# EAGLE schematic 4key1SliderCapsenseDesign (EAGLE 6.3)
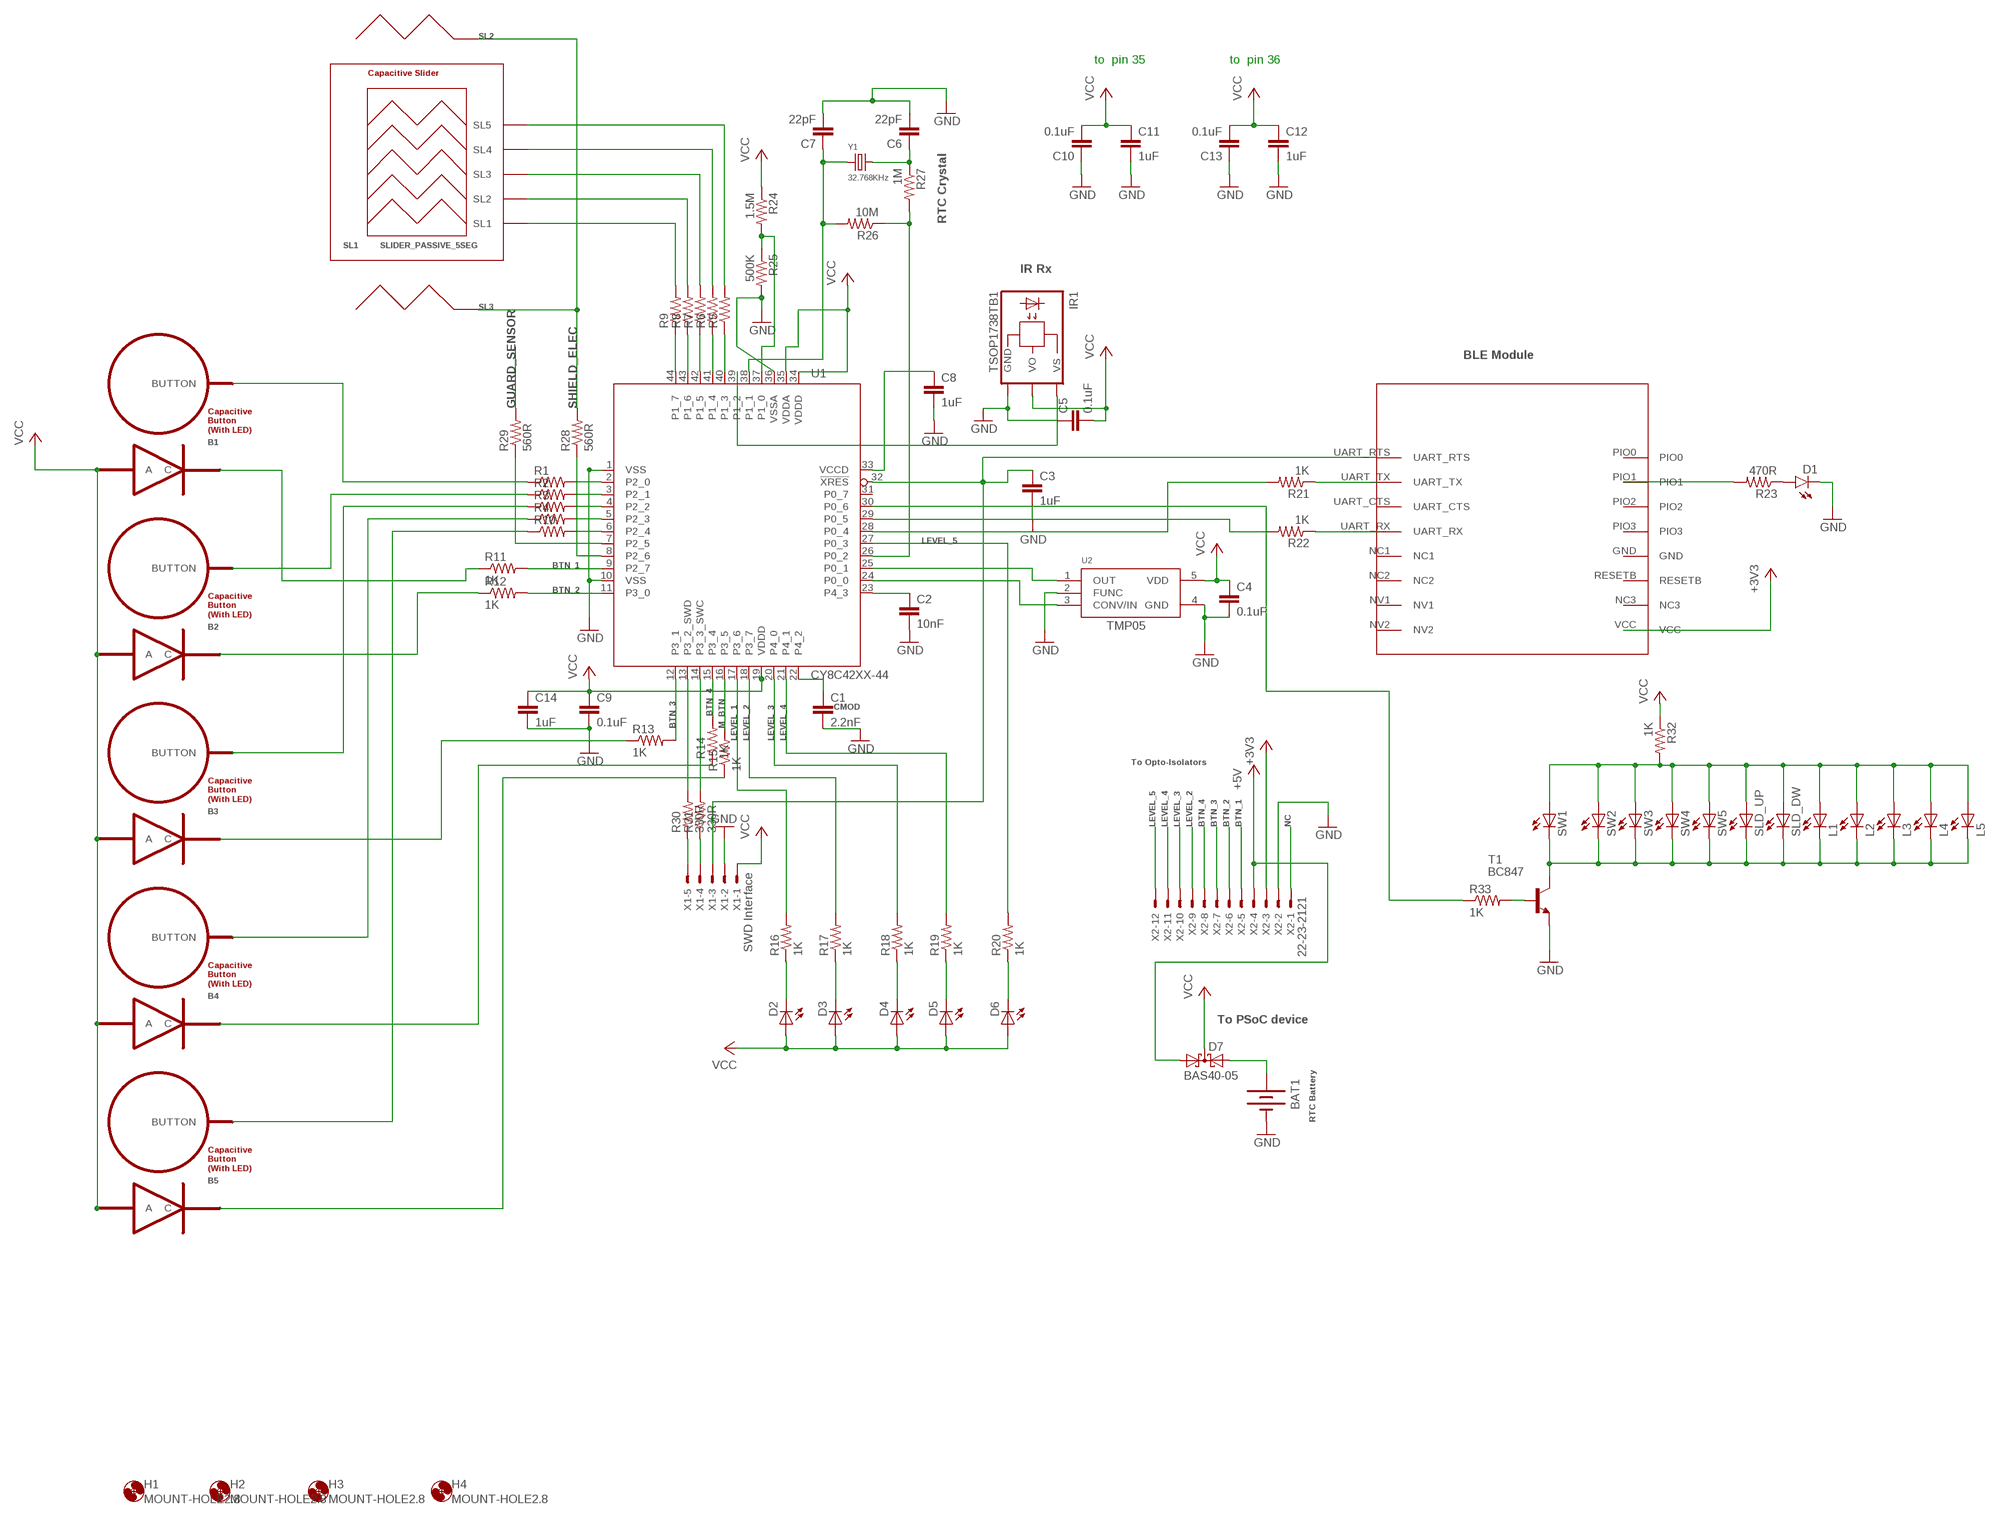
[diagram p0: schematic, sheet 1]

## Parts
B1  BUTTON_PASSIVE_LED  [BUTTON_PASSIVE_12MM_LED]
B2  BUTTON_PASSIVE_LED  [BUTTON_PASSIVE_12MM_LED]
B3  BUTTON_PASSIVE_LED  [BUTTON_PASSIVE_12MM_LED]
B4  BUTTON_PASSIVE_LED  [BUTTON_PASSIVE_12MM_LED]
B5  BUTTON_PASSIVE_LED  [BUTTON_PASSIVE_12MM_LED]
BAT1  BATTERY245MM  [BATTCON_245MM]
C1  2.2nF  CAP1206  [1206]
C2  10nF  CAP1206  [1206]
C3  1uF  CAP1206  [1206]
C4  0.1uF  CAP1206  [1206]
C5  0.1uF  CAP1206  [1206]
C6  22pF  CAP1206  [1206]
C7  22pF  CAP1206  [1206]
C8  1uF  CAP1206  [1206]
C9  0.1uF  CAP1206  [1206]
C10  0.1uF  CAP1206  [1206]
C11  1uF  CAP1206  [1206]
C12  1uF  CAP1206  [1206]
C13  0.1uF  CAP1206  [1206]
C14  1uF  CAP1206  [1206]
D1  LED1206-BOTTOM  [LED-1206-BOTTOM]
D2  LEDCHIP-LED0805  [CHIP-LED0805]
D3  LEDCHIP-LED0805  [CHIP-LED0805]
D4  LEDCHIP-LED0805  [CHIP-LED0805]
D5  LEDCHIP-LED0805  [CHIP-LED0805]
D6  LEDCHIP-LED0805  [CHIP-LED0805]
D7  BAS40-05  [SOT23]
H1  MOUNT-HOLE2.8  [2,8]
H2  MOUNT-HOLE2.8  [2,8]
H3  MOUNT-HOLE2.8  [2,8]
H4  MOUNT-HOLE2.8  [2,8]
IR1  TSOP1738TB1  [TSOP17_TB1]
L1  LEDCHIPLED_1206  [CHIPLED_1206]
L2  LEDCHIPLED_1206  [CHIPLED_1206]
L3  LEDCHIPLED_1206  [CHIPLED_1206]
L4  LEDCHIPLED_1206  [CHIPLED_1206]
L5  LEDCHIPLED_1206  [CHIPLED_1206]
R1  RESISTOR1206  [1206]
R2  RESISTOR1206  [1206]
R3  RESISTOR1206  [1206]
R4  RESISTOR1206  [1206]
R5  RESISTOR1206  [1206]
R6  RESISTOR1206  [1206]
R7  RESISTOR1206  [1206]
R8  RESISTOR1206  [1206]
R9  RESISTOR1206  [1206]
R10  RESISTOR1206  [1206]
R11  1K  RESISTOR1206  [1206]
R12  1K  RESISTOR1206  [1206]
R13  1K  RESISTOR1206  [1206]
R14  1K  RESISTOR1206  [1206]
R15  1K  RESISTOR1206  [1206]
R16  1K  RESISTOR1206  [1206]
R17  1K  RESISTOR1206  [1206]
R18  1K  RESISTOR1206  [1206]
R19  1K  RESISTOR1206  [1206]
R20  1K  RESISTOR1206  [1206]
R21  1K  RESISTOR1206  [1206]
R22  1K  RESISTOR1206  [1206]
R23  470R  RESISTOR1206  [1206]
R24  1.5M  RESISTOR1206  [1206]
R25  500K  RESISTOR1206  [1206]
R26  10M  RESISTOR1206  [1206]
R27  1M  RESISTOR1206  [1206]
R28  560R  RESISTOR1206  [1206]
R29  560R  RESISTOR1206  [1206]
R30  330R  RESISTOR1206  [1206]
R31  330R  RESISTOR1206  [1206]
R32  1K  RESISTOR1206  [1206]
R33  1K  RESISTOR1206  [1206]
SL1  SLIDER_PASSIVE_5SEG  [SLIDER_PASSIVE_5SEG_12MM]
SL2  SLIDER_PASSIVE_1SEG  [SLIDER_PASSIVE_1SEG_12MM]
SL3  SLIDER_PASSIVE_1SEG  [SLIDER_PASSIVE_1SEG_12MM]
SLD_DW  LEDCHIPLED_1206  [CHIPLED_1206]
SLD_UP  LEDCHIPLED_1206  [CHIPLED_1206]
SW1  LEDCHIPLED_1206  [CHIPLED_1206]
SW2  LEDCHIPLED_1206  [CHIPLED_1206]
SW3  LEDCHIPLED_1206  [CHIPLED_1206]
SW4  LEDCHIPLED_1206  [CHIPLED_1206]
SW5  LEDCHIPLED_1206  [CHIPLED_1206]
T1  BC847  [SOT23]
U1  CY8C42XX-44  [TQFP-10X10-44]
U2  NCP1400A_STEPUP  [SOT23-5]
U$1  HM-11  [HM-11]
X1  SWD Interface  22-23-2051  [22-23-2051]
X2  22-23-2121  [22-23-2121]
Y1  32.768KHz  CRYSTAL32.768  [CRYSTAL_CYL_2X6MM_SMT]

## Nets
+3V3: U$1.VCC X2.3
+5V: D7.1(A1) X2.4
BTN_1: R11.2 U1.9(P2_7) X2.5
BTN_2: R12.2 U1.11(P3_0) X2.6
BTN_3: R13.2 U1.12(P3_1) X2.7
BTN_4: R14.2 U1.15(P3_4) X2.8
GND: BAT1.2(-) C1.2 C2.2 C3.2 C4.2 C5.1 C6.2 C7.2 C8.2 C9.2 C10.1 C11.2 C12.2 C13.1 C14.2 D1.C IR1.GND R25.2 T1.2(E) U1.1(VSS) U1.10(VSS) U1.36(VSSA) U2.2(FUNC) U2.4(GND) X1.2 X2.2
GUARD_SENSOR: R29.1 R29.2 U1.7(P2_5)
LEVEL_1: R16.2 U1.17(P3_6)
LEVEL_2: R17.2 U1.18(P3_7) X2.9
LEVEL_3: R18.2 U1.20(P4_0) X2.10
LEVEL_4: R19.2 U1.21(P4_1) X2.11
LEVEL_5: R20.2 U1.27(P0_3) X2.12
M_BTN: R15.2 U1.16(P3_5)
N$1: C1.1 U1.22(P4_2)
N$2: R1.2 U1.2(P2_0)
N$3: C2.1 U1.23(P4_3)
N$4: R2.2 U1.3(P2_1)
N$5: R3.2 U1.4(P2_2)
N$6: R4.2 U1.5(P2_3)
N$7: B1.BUTTON R1.1
N$8: B2.BUTTON R2.1
N$9: B3.BUTTON R3.1
N$10: B4.BUTTON R4.1
N$11: R10.2 U1.6(P2_4)
N$12: B5.BUTTON R10.1
N$13: R5.1 U1.40(P1_3)
N$14: R6.1 U1.41(P1_4)
N$15: R7.1 U1.42(P1_5)
N$16: R8.1 U1.43(P1_6)
N$17: R9.1 U1.44(P1_7)
N$18: R9.2 SL1.SL1
N$19: R8.2 SL1.SL2
N$20: R7.2 SL1.SL3
N$21: R6.2 SL1.SL4
N$22: R5.2 SL1.SL5
N$23: R28.1 U1.8(P2_6)
N$24: B1.C R11.1
N$25: B2.C R12.1
N$26: B3.C R13.1
N$27: B4.C R14.1
N$28: B5.C R15.1
N$29: R30.2 U1.13(P3_2_SWD)
N$30: C8.1 U1.33(VCCD)
N$31: R30.1 X1.5
N$32: R31.2 U1.14(P3_3_SWC)
N$33: R31.1 X1.4
N$34: L1.A L2.A L3.A L4.A L5.A R32.2 SLD_DW.A SLD_UP.A SW1.A SW2.A SW3.A SW4.A SW5.A
N$35: D2.C R16.1
N$36: L1.C L2.C L3.C L4.C L5.C SLD_DW.C SLD_UP.C SW1.C SW2.C SW3.C SW4.C SW5.C T1.3(C)
N$37: D3.C R17.1
N$38: R33.2 T1.1(B)
N$39: BAT1.1(+) D7.2(A2)
N$41: C3.1 U1.32(!XRES) U$1.UART_RTS X1.3
N$42: R21.1 U$1.UART_TX
N$43: R33.1 U1.30(P0_6)
N$44: R22.1 U$1.UART_RX
N$45: R21.2 U1.28(P0_4)
N$46: R22.2 U1.29(P0_5)
N$47: D1.A R23.1
N$48: U1.24(P0_0) U2.3(CONV/IN)
N$49: R23.2 U$1.PIO1
N$50: U1.25(P0_1) U2.1(OUT)
N$51: IR1.VS U1.39(P1_2)
N$52: R24.2 R25.1 U1.37(P1_0)
N$57: R26.1 R27.2 U1.26(P0_2)
N$58: C6.1 R27.1 Y1.2
N$59: C7.1 R26.2 U1.38(P1_1) Y1.1
N$61: D6.C R20.1
N$63: D5.C R19.1
N$64: D4.C R18.1
NC: X2.1
SHIELD_ELEC: R28.2 SL2.S1(SL1) SL3.S1(SL1)
VCC: B1.A B2.A B3.A B4.A B5.A C4.1 C5.2 C9.1 C10.2 C11.1 C12.1 C13.2 C14.1 D2.A D3.A D4.A D5.A D6.A D7.3(C) IR1.VO R24.1 R32.1 U1.19(VDDD) U1.34(VDDD) U1.35(VDDA) U2.5(VDD) X1.1
Unconnected: U1.31(P0_7) U$1.GND U$1.NC1 U$1.NC2 U$1.NC3 U$1.NV1 U$1.NV2 U$1.PIO0 U$1.PIO2 U$1.PIO3 U$1.RESETB U$1.UART_CTS

## Notes on the sheet
- to  pin 35 | to  pin 36
- RTC Crystal
- IR Rx
- BLE Module
- TMP05
- CMOD
- To Opto-Isolators
- To PSoC device
- RTC Battery

## Library data of the parts
B1-B5 = PatternAgents-TouchWidgets:BUTTON_PASSIVE_LED: Button, Passive Touch/Capacitive Sensing Type, with LED & Hole Source : http://www.PatternAgents.com Github : https://github.com/PatternAgents License : http://creativecommons.org/licenses/by-sa/3.1/ (Creative Commons 3.1) THIS SOFTWARE IS PROVIDED BY THE CONTRIBUTORS "AS IS" AND WITHOUT ANY EXPRESS OR IMPLIED WARRANTIES, INCLUDING, BUT NOT LIMITED TO, THE IMPLIED WARRANTIES OF MERCHANTABILITY AND FITNESS FOR A PARTICULAR PURPOSE ARE DISCLAIMED. IN NO EVENT SHALL THE COPYRIGHT OWNER OR CONTRIBUTORS BE LIABLE FOR ANY DIRECT, INDIRECT, INCIDENTAL, SPECIAL, EXEMPLARY, OR CONSEQUENTIAL DAMAGES (INCLUDING, BUT NOT LIMITED TO, PROCUREMENT OF SUBSTITUTE GOODS OR SERVICES; LOSS OF USE, DATA, OR PROFITS; OR BUSINESS INTERRUPTION) HOWEVER CAUSED AND ON ANY THEORY OF LIABILITY, WHETHER IN CONTRACT, STRICT LIABILITY, OR TORT (INCLUDING NEGLIGENCE OR OTHERWISE) ARISING IN ANY WAY OUT OF THE USE OF THIS SOFTWARE, EVEN IF ADVISED OF THE POSSIBILITY OF SUCH DAMAGE.
BAT1 = SparkFun-Electromechanical:BATTERY: Battery Holders Various common sizes : AA, AAA, 18650 (PRT-12895), 20mm coin cell and 12mm coin cell. 20MM_4LEGS, BATT-10373
C1-C14 = SparkFun-Capacitors:CAP: Capacitor Standard 0603 ceramic capacitor, and 0.1" leaded capacitor.
D1 = SparkFun-LED:LED: LEDs Standard schematic elements and footprints for 5mm, 3mm, 1206, and 0603 sized LEDs. 5mm - Spark Fun Electronics SKU : COM-00529 (and others)
D2-D6 L1-L5 SLD_DW SLD_UP SW1-SW5 = led:LED: LED OSRAM: - CHIPLED LG R971, LG N971, LY N971, LG Q971, LY Q971, LO R971, LY R971 LH N974, LH R974 LS Q976, LO Q976, LY Q976 LO Q996 - Hyper CHIPLED LW Q18S LB Q993, LB Q99A, LB R99A - SideLED LS A670, LO A670, LY A670, LG A670, LP A670 LB A673, LV A673, LT A673, LW A673 LH A674 LY A675 LS A676, LA A676, LO A676, LY A676, LW A676 LS A679, LY A679, LG A679 - Hyper Micro SIDELED® LS Y876, LA Y876, LO Y876, LY Y876 LT Y87S - SmartLED LW L88C, LW L88S LB L89C, LB L89S, LG L890 LS L89K, LO L89K, LY L89K LS L896, LA L896, LO L896, LY L896 - TOPLED LS T670, LO T670, LY T670, LG T670, LP T670 LSG T670, LSP T670, LSY T670, LOP T670, LYG T670 LG T671, LOG T671, LSG T671 LB T673, LV T673, LT T673, LW T673 LH T674 LS T676, LA T676, LO T676, LY T676, LB T676, LH T676, LSB T676, LW T676 LB T67C, LV T67C, LT T67C, LS T67K, LO T67K, LY T67K, LW E67C LS E67B, LA E67B, LO E67B, LY E67B, LB E67C, LV E67C, LT E67C LW T67C LS T679, LY T679, LG T679 LS T770, LO T770, LY T770, LG T770, LP T770 LB T773, LV T773, LT T773, LW T773 LH T774 LS E675, LA E675, LY E675, LS T675 LS T776, LA T776, LO T776, LY T776, LB T776 LHGB T686 LT T68C, LB T68C - Hyper Mini TOPLED® LB M676 - Mini TOPLED Santana® LG M470 LS M47K, LO M47K, LY M47K Source: http://www.osram.convergy.de LUXEON: - LUMILED® LXK2-PW12-R00, LXK2-PW12-S00, LXK2-PW14-U00, LXK2-PW14-V00 LXK2-PM12-R00, LXK2-PM12-S00, LXK2-PM14-U00 LXK2-PE12-Q00, LXK2-PE12-R00, LXK2-PE12-S00, LXK2-PE14-T00, LXK2-PE14-U00 LXK2-PB12-K00, LXK2-PB12-L00, LXK2-PB12-M00, LXK2-PB14-N00, LXK2-PB14-P00, LXK2-PB14-Q00 LXK2-PR12-L00, LXK2-PR12-M00, LXK2-PR14-Q00, LXK2-PR14-R00 LXK2-PD12-Q00, LXK2-PD12-R00, LXK2-PD12-S00 LXK2-PH12-R00, LXK2-PH12-S00 LXK2-PL12-P00, LXK2-PL12-Q00, LXK2-PL12-R00 Source: www.luxeon.com KINGBRIGHT: KA-3528ASYC Source: www.kingbright.com
D7 = diode:BAS40-05: Silicon Schottky Diodes General-purpose diode for high-speed switching
H1-H4 = holes:MOUNT-HOLE: MOUNTING HOLE with drill center marker
IR1 = telefunken:TSOP17*TB1: TSOP17..TB1 IR Receiver Modules for Remote Control Systems Source: http://www.vishay.com/docs/82042/82042.pdf; OC_FARNELL: unknown; OC_NEWARK: unknown
R1-R33 = SparkFun-Passives:RESISTOR: Resistor Basic schematic elements and footprints for 0603, 1206, and PTH resistors.
SL1 = PatternAgents-TouchWidgets:SLIDER_PASSIVE_5SEG: Slider, Passive Touch/Capacitive Sensing Type, Five (5) Segment Source : http://www.PatternAgents.com Github : https://github.com/PatternAgents License : http://creativecommons.org/licenses/by-sa/3.1/ (Creative Commons 3.1) THIS SOFTWARE IS PROVIDED BY THE CONTRIBUTORS "AS IS" AND WITHOUT ANY EXPRESS OR IMPLIED WARRANTIES, INCLUDING, BUT NOT LIMITED TO, THE IMPLIED WARRANTIES OF MERCHANTABILITY AND FITNESS FOR A PARTICULAR PURPOSE ARE DISCLAIMED. IN NO EVENT SHALL THE COPYRIGHT OWNER OR CONTRIBUTORS BE LIABLE FOR ANY DIRECT, INDIRECT, INCIDENTAL, SPECIAL, EXEMPLARY, OR CONSEQUENTIAL DAMAGES (INCLUDING, BUT NOT LIMITED TO, PROCUREMENT OF SUBSTITUTE GOODS OR SERVICES; LOSS OF USE, DATA, OR PROFITS; OR BUSINESS INTERRUPTION) HOWEVER CAUSED AND ON ANY THEORY OF LIABILITY, WHETHER IN CONTRACT, STRICT LIABILITY, OR TORT (INCLUDING NEGLIGENCE OR OTHERWISE) ARISING IN ANY WAY OUT OF THE USE OF THIS SOFTWARE, EVEN IF ADVISED OF THE POSSIBILITY OF SUCH DAMAGE.
SL2 SL3 = PatternAgents-TouchWidgets:SLIDER_PASSIVE_1SEG: Slider, Passive Touch/Capacitive Sensing Type, One (1) Segment Source : http://www.PatternAgents.com Github : https://github.com/PatternAgents License : http://creativecommons.org/licenses/by-sa/3.1/ (Creative Commons 3.1) THIS SOFTWARE IS PROVIDED BY THE CONTRIBUTORS "AS IS" AND WITHOUT ANY EXPRESS OR IMPLIED WARRANTIES, INCLUDING, BUT NOT LIMITED TO, THE IMPLIED WARRANTIES OF MERCHANTABILITY AND FITNESS FOR A PARTICULAR PURPOSE ARE DISCLAIMED. IN NO EVENT SHALL THE COPYRIGHT OWNER OR CONTRIBUTORS BE LIABLE FOR ANY DIRECT, INDIRECT, INCIDENTAL, SPECIAL, EXEMPLARY, OR CONSEQUENTIAL DAMAGES (INCLUDING, BUT NOT LIMITED TO, PROCUREMENT OF SUBSTITUTE GOODS OR SERVICES; LOSS OF USE, DATA, OR PROFITS; OR BUSINESS INTERRUPTION) HOWEVER CAUSED AND ON ANY THEORY OF LIABILITY, WHETHER IN CONTRACT, STRICT LIABILITY, OR TORT (INCLUDING NEGLIGENCE OR OTHERWISE) ARISING IN ANY WAY OUT OF THE USE OF THIS SOFTWARE, EVEN IF ADVISED OF THE POSSIBILITY OF SUCH DAMAGE.
T1 = transistor:BC847: NPN TRANSISTOR
U1 = PatternAgents-Cypress:CY8C42XX-44: Cypress PSoC® 4 - Programmable System on Chip, Cortex-M0 Based http://www.cypress.com/?mpn=CY8C4245AXI-483 LBR Source: http://www.patternagents.com THIS SOFTWARE IS PROVIDED BY THE CONTRIBUTORS "AS IS" AND WITHOUT ANY EXPRESS OR IMPLIED WARRANTIES, INCLUDING, BUT NOT LIMITED TO, THE IMPLIED WARRANTIES OF MERCHANTABILITY AND FITNESS FOR A PARTICULAR PURPOSE ARE DISCLAIMED. IN NO EVENT SHALL THE COPYRIGHT OWNER OR CONTRIBUTORS BE LIABLE FOR ANY DIRECT, INDIRECT, INCIDENTAL, SPECIAL, EXEMPLARY, OR CONSEQUENTIAL DAMAGES (INCLUDING, BUT NOT LIMITED TO, PROCUREMENT OF SUBSTITUTE GOODS OR SERVICES; LOSS OF USE, DATA, OR PROFITS; OR BUSINESS INTERRUPTION) HOWEVER CAUSED AND ON ANY THEORY OF LIABILITY, WHETHER IN CONTRACT, STRICT LIABILITY, OR TORT (INCLUDING NEGLIGENCE OR OTHERWISE) ARISING IN ANY WAY OUT OF THE USE OF THIS SOFTWARE, EVEN IF ADVISED OF THE POSSIBILITY OF SUCH DAMAGE.
U2 = microbuilder:NCP1400A_STEPUP: NCP1400A - 100mA PWM Step-Up Regulator 100mA step-up DC-to-DC converter with low 0.8V startup. 3.3V Version (SOT23-5) - Digikey: NCP1400ASN33T1GOSCT-ND 5.0V Version (SOT23-5) - Digikey: NCP1400ASN50T1GOSCT-ND NCP1402 - 200mA PWM Step-Up Regulator 200mA step-up DC-to-DC converter with low 0.8V startup 3.3V Version (SOT23-5) - Digikey: NCP1402SN33T1GOSCT-ND 5.0V Version (SOT23-5) - Digikey: NCP1402SN50T1GOSCT-ND
U$1 = HM-11:HM-11
X1 = con-molex:22-23-2051: .100" (2.54mm) Center Header - 5 Pin; MF: MOLEX; MPN: 22-23-2051; OC_FARNELL: 1462952; OC_NEWARK: 38C9178
X2 = con-molex:22-23-2121: .100" (2.54mm) Center Header - 12 Pin; MF: MOLEX; MPN: 22-23-2121; OC_FARNELL: 1462935; OC_NEWARK: 56H0456
Y1 = microbuilder:CRYSTAL: Crystals HC49UP - Surface Mount Crystal 4.0MHz 18pF +/-30ppm Surface Mount Crystal [Digikey: 535-9857-1-ND] 12.0 MHz Surface Mount Crystal [Digikey: 535-9869-6-ND] 25.0 MHz Surface Mount Crystal [Digikey: 535-9078-1-ND] 2.5 x 2.0mm - MEMs SMT Crystal 16.0 MHz 10pF 20ppm 2.5 x 2.0mm Crystal [Digikey -40-85°C: 535-10923-1-ND] 3.2 x 2.5mm - MEMs SMT Crystal 12.0 MHz 8pF 15ppm 3.2 x 2.5mm Crystal [Digikey: -10-70°C: 644-1047-1-ND -40-125°C: 644-1128-1-ND] 16.0 MHz 8pF 15ppm 3.2 x 2.5mm Crystal [Digikey: -10-70°C: 644-1049-1-ND -40-125°C: 644-1129-2-ND] 16.0 MHz 10pF 10ppm 3.2 x 2.5mm Crystal [Digikey: 644-1100-1-ND] 27.12 MHz 18pF 30ppm 3.2 x 2.5mm Crystal [Digikey: 887-1424-1-ND] 27.12MHz 10pF 10ppm 3.2 x 2.5mm Crystal [Digikey: 887-1329-1-ND] 4.9 x 1.8mm - MEMs SMT Crystal 32.768 KHz 12.5pF 20ppm 4.9 x 1.8mm Crystal [Digikey: SE2415CT-ND] 8.0 x 3.8mm - Surface Mount Crystal 32.768kHz 12.5pF 20ppm -40°C-85°C [Digikey: 535-9166-2-ND] Cylinder 32.768KHz Cylinder Crystal (2x6mm body) [Ex. Digikey: 300-8341-2-ND]